# EAGLE design do_ph (EAGLE 9.3.2)
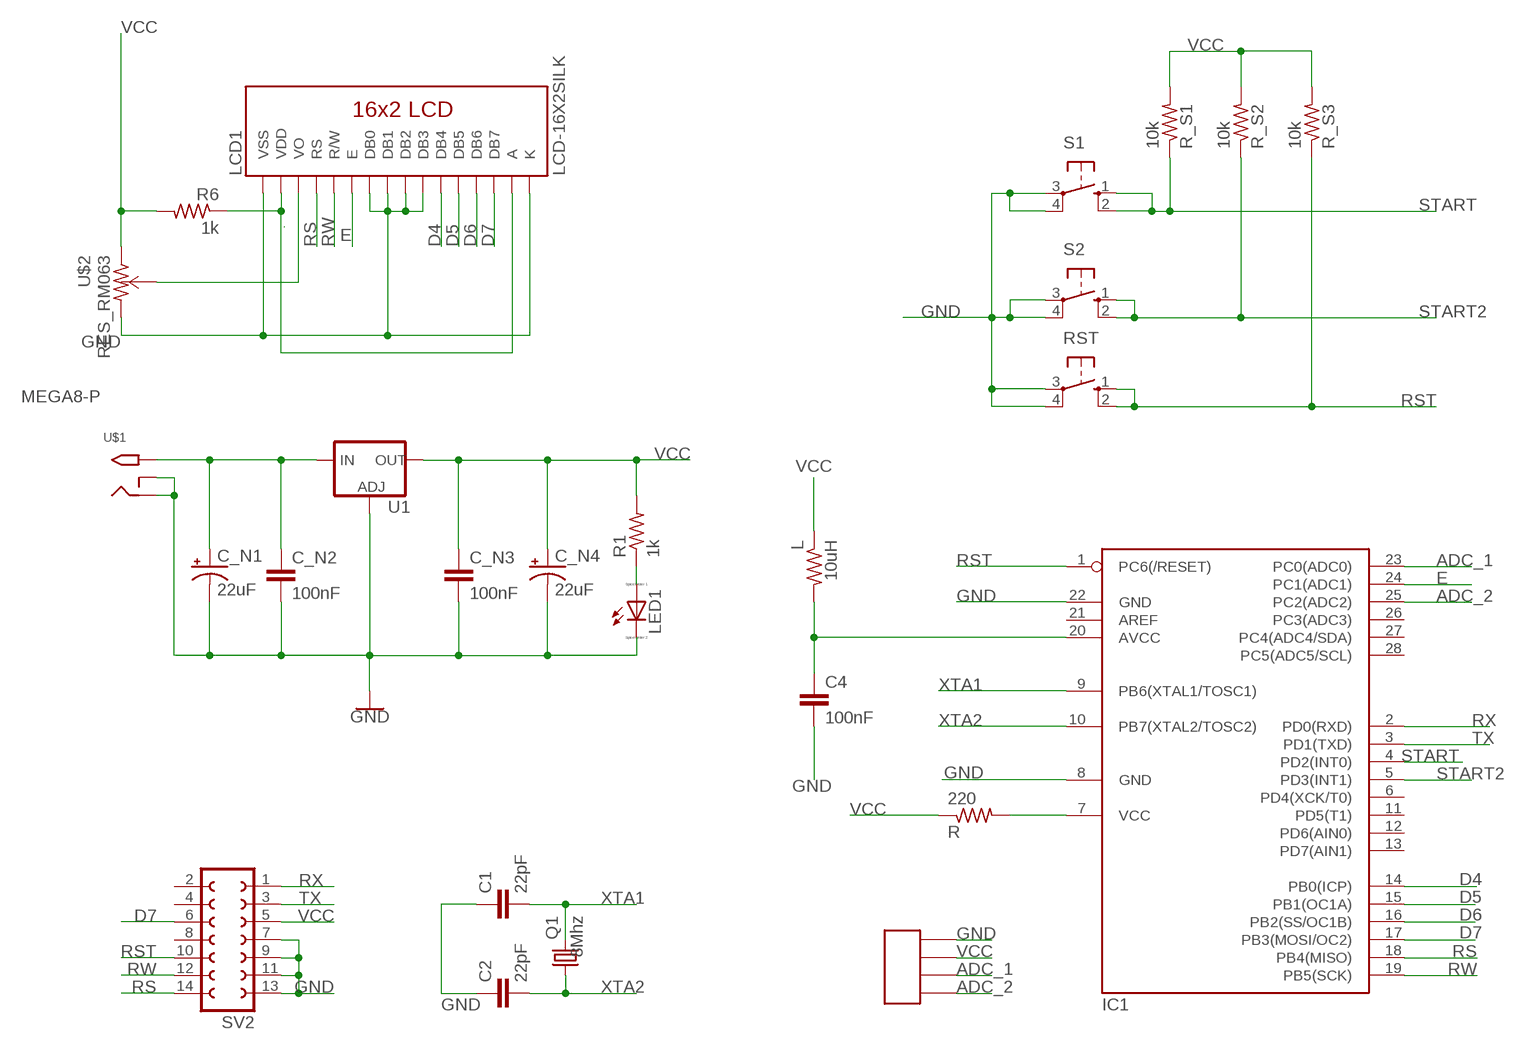
[diagram p0: schematic, sheet 1]

## Parts
C1  22pF  2.2UF-CERCAP-07888  [0402-CAP]
C2  22pF  2.2UF-CERCAP-07888  [0402-CAP]
C4  100nF  1.0UF-0805-25V-(+80/-20%)  [0805]
C_N1  22uF  CPOL-USCT7343  [CT7343]
C_N2  100nF  1.0UF-0805-25V-(+80/-20%)  [0805]
C_N3  100nF  1.0UF-0805-25V-(+80/-20%)  [0805]
C_N4  22uF  CPOL-USCT7343  [CT7343]
IC1  MEGA8-P  [DIL28-3]
L  10uH  R-US_R0805  [R0805]
LCD1  LCD-16X2SILK  [LCD-16X2]
LED1  LED_E  [LED_1206]
Q1  8Mhz  CRYSTALHC49S  [HC49/S]
R  220  R-US_R0805  [R0805]
R1  1k  R-US_R0805  [R0805]
R6  1k  R-US_R0805  [R0805]
R_S1  10k  R-US_R0805  [R0805]
R_S2  10k  R-US_R0805  [R0805]
R_S3  10k  R-US_R0805  [R0805]
RST  10-XX  [B3F-10XX]
S1  10-XX  [B3F-10XX]
S2  10-XX  [B3F-10XX]
SV2  FE07-2  [FE07-2]
U1  V_REG_LM1117SOT223  [SOT223]
U$1  2.1MMJACK  [PJ-102A]
U$2  RES_RM063  [RM063]
U$5  PH_SENSOR_DFROBOT  [PH_DFROBOT]

## Nets
ADC_1: IC1.23(PC0(ADC0)) U$5.S_A(P_A)
ADC_2: IC1.25(PC2(ADC2)) U$5.S_A2(P_A2)
D4: IC1.14(PB0(ICP)) LCD1.11(DB4)
D5: IC1.15(PB1(OC1A)) LCD1.12(DB5)
D6: IC1.16(PB2(SS/OC1B)) LCD1.13(DB6)
D7: IC1.17(PB3(MOSI/OC2)) LCD1.14(DB7) SV2.6
E: IC1.24(PC1(ADC1)) LCD1.6(E)
GND: C1.1 C2.1 C4.2 C_N1.- C_N2.2 C_N3.2 C_N4.- IC1.8(GND) IC1.22(GND) LCD1.1(VSS) LCD1.7(DB0) LCD1.8(DB1) LCD1.9(DB2) LCD1.10(DB3) LCD1.16(K) LED1.C RST.3(P) RST.4(P1) S1.3(P) S1.4(P1) S2.3(P) S2.4(P1) SV2.7 SV2.9 SV2.11 SV2.13 U1.1(ADJ) U$1.RING U$1.RING_SW U$2.P$2 U$5.S_GND(P_GND)
N$1: LCD1.3(VO) U$2.P$3
N$2: C_N1.+ C_N2.1 U1.3(IN) U$1.TIP
N$5: LED1.A R1.1
N$6: C4.1 IC1.20(AVCC) L.2
N$11: IC1.7(VCC) R.2
RS: IC1.18(PB4(MISO)) LCD1.4(RS) SV2.14
RST: IC1.1(PC6(/RESET)) R_S3.1 RST.1(S) RST.2(S1) SV2.10
RW: IC1.19(PB5(SCK)) LCD1.5(R/W) SV2.12
RX: IC1.2(PD0(RXD)) SV2.1
START: IC1.4(PD2(INT0)) R_S1.1 S1.1(S) S1.2(S1)
START2: IC1.5(PD3(INT1)) R_S2.1 S2.1(S) S2.2(S1)
TX: IC1.3(PD1(TXD)) SV2.3
VCC: C_N3.1 C_N4.+ L.1 R1.2 R6.2 R.1 R_S1.2 R_S2.2 R_S3.2 SV2.5 U1.2(OUT) U1.4(OUT) U$2.P$1 U$5.S_VCC(P_VCC)
VO: LCD1.2(VDD) LCD1.15(A) R6.1
XTA1: C1.2 IC1.9(PB6(XTAL1/TOSC1)) Q1.2
XTA2: C2.2 IC1.10(PB7(XTAL2/TOSC2)) Q1.1
Unconnected: IC1.6(PD4(XCK/T0)) IC1.11(PD5(T1)) IC1.12(PD6(AIN0)) IC1.13(PD7(AIN1)) IC1.21(AREF) IC1.26(PC3(ADC3)) IC1.27(PC4(ADC4/SDA)) IC1.28(PC5(ADC5/SCL)) SV2.2 SV2.4 SV2.8

## Library data of the parts
C1 C2 = SparkFun-Retired:2.2UF-CER: 2.2uF Ceramic SMT CAP-07888- 10V, 20% (0603) CAP-10009- 50V, 10% (1206); PROD_ID: CAP-07888; VALUE: 2.2uF
C4 C_N2 C_N3 = SparkFun-Capacitors:1.0UF: 1µF ceramic capacitors A capacitor is a passive two-terminal electrical component used to store electrical energy temporarily in an electric field.; PROD_ID: CAP-11625; VALUE: 1.0uF
C_N1 C_N4 = rcl:CPOL-US: POLARIZED CAPACITOR, American symbol; SPICEPREFIX: C
IC1 = atmel:MEGA8-P: MICROCONTROLLER 8 Kbytes FLASH, 1 kbytes SRAM, 512 bytes EEPROM, USART, 4-channel 10 bit ADC, 2-channel 8 bit ADC Pin compatible with Atmega48, ATMega88, ATMega168 Source: avr.lbr; OC_FARNELL: unknown; OC_NEWARK: unknown
L R R1 R6 R_S1-R_S3 = adafruit:R-US_: RESISTOR, American symbol
LCD1 = SparkFun-Displays:LCD-16X2: Standard text-only 16x2 parallel input LCD Basic 16 character by 2 line display. Typically utilizes the extremely common HD44780 parallel interface chipset SparkFun Products: Basic 16x2 Green <https://www.sparkfun.com/products/255> Basic 8x2 Green <https://www.sparkfun.com/products/11122>; SF_ID: LCD-00255
LED1 = eagle-ltspice:LED_E: LED Source: http://www.osram.convergy.de Source: www.luxeon.com Source: www.kingbright.com; SPICEMODEL: NONE; SPICEPREFIX: D; SPICETYPE: diode
Q1 = crystal:CRYSTAL: CRYSTAL; OC_FARNELL: 1667008; OC_NEWARK: unknown
RST S1 S2 = switch-omron:10-XX: OMRON SWITCH; MPN: B3F-1000; OC_FARNELL: 176432; OC_NEWARK: 36M3542
SV2 = con-lsta:FE07-2: FEMALE HEADER; OC_FARNELL: unknown; OC_NEWARK: unknown
U1 = SparkFun-IC-Power:V_REG_LM1117: Voltage Regulator LM1117 Standard adjustable voltage regulator but in SMD form. Spark Fun Electronics SKU : COM-00595; PROD_ID: VREG-08170
U$1 = adafruit:2.1MMJACK: 2.1mm x 5.5mm DC jack with internal switch. Digikey part #PJ-102A, 4UCON part #05537 By microbuilder.eu
U$2 = res_RM063:RES_RM063
U$5 = PH_SENSOR_DFROBOT:PH_SENSOR_DFROBOT

## Board
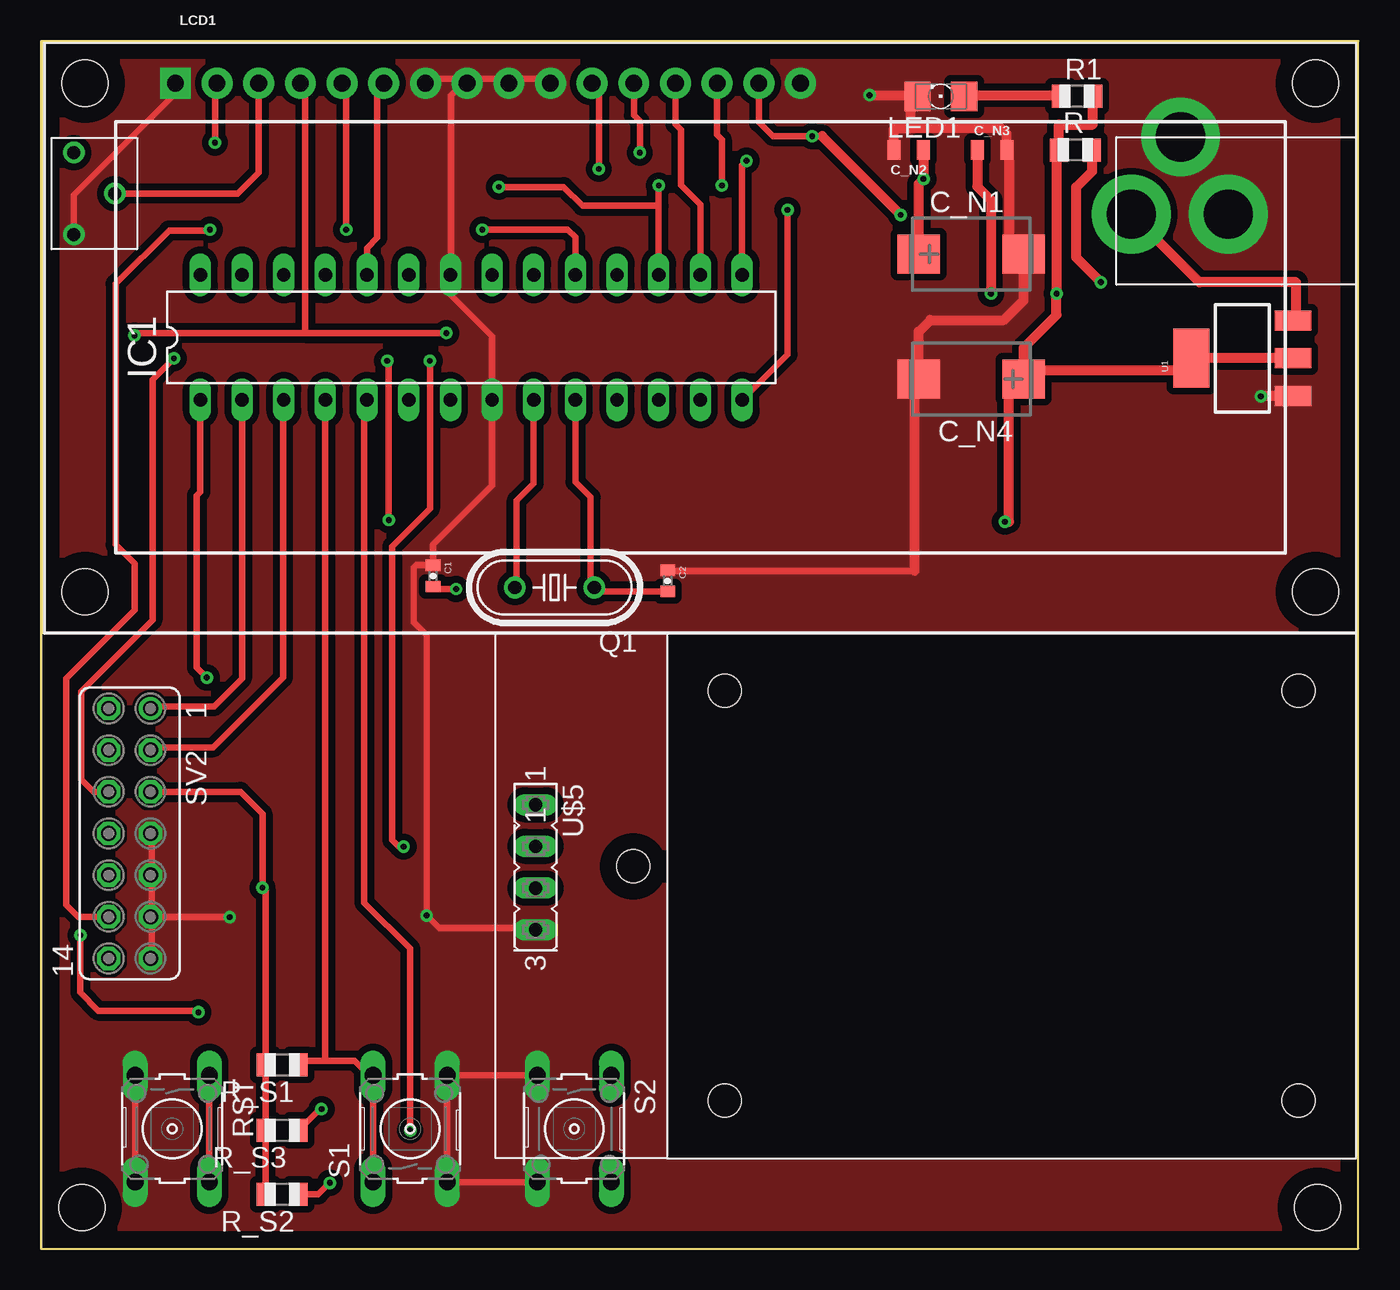
[diagram p1: board, top side]
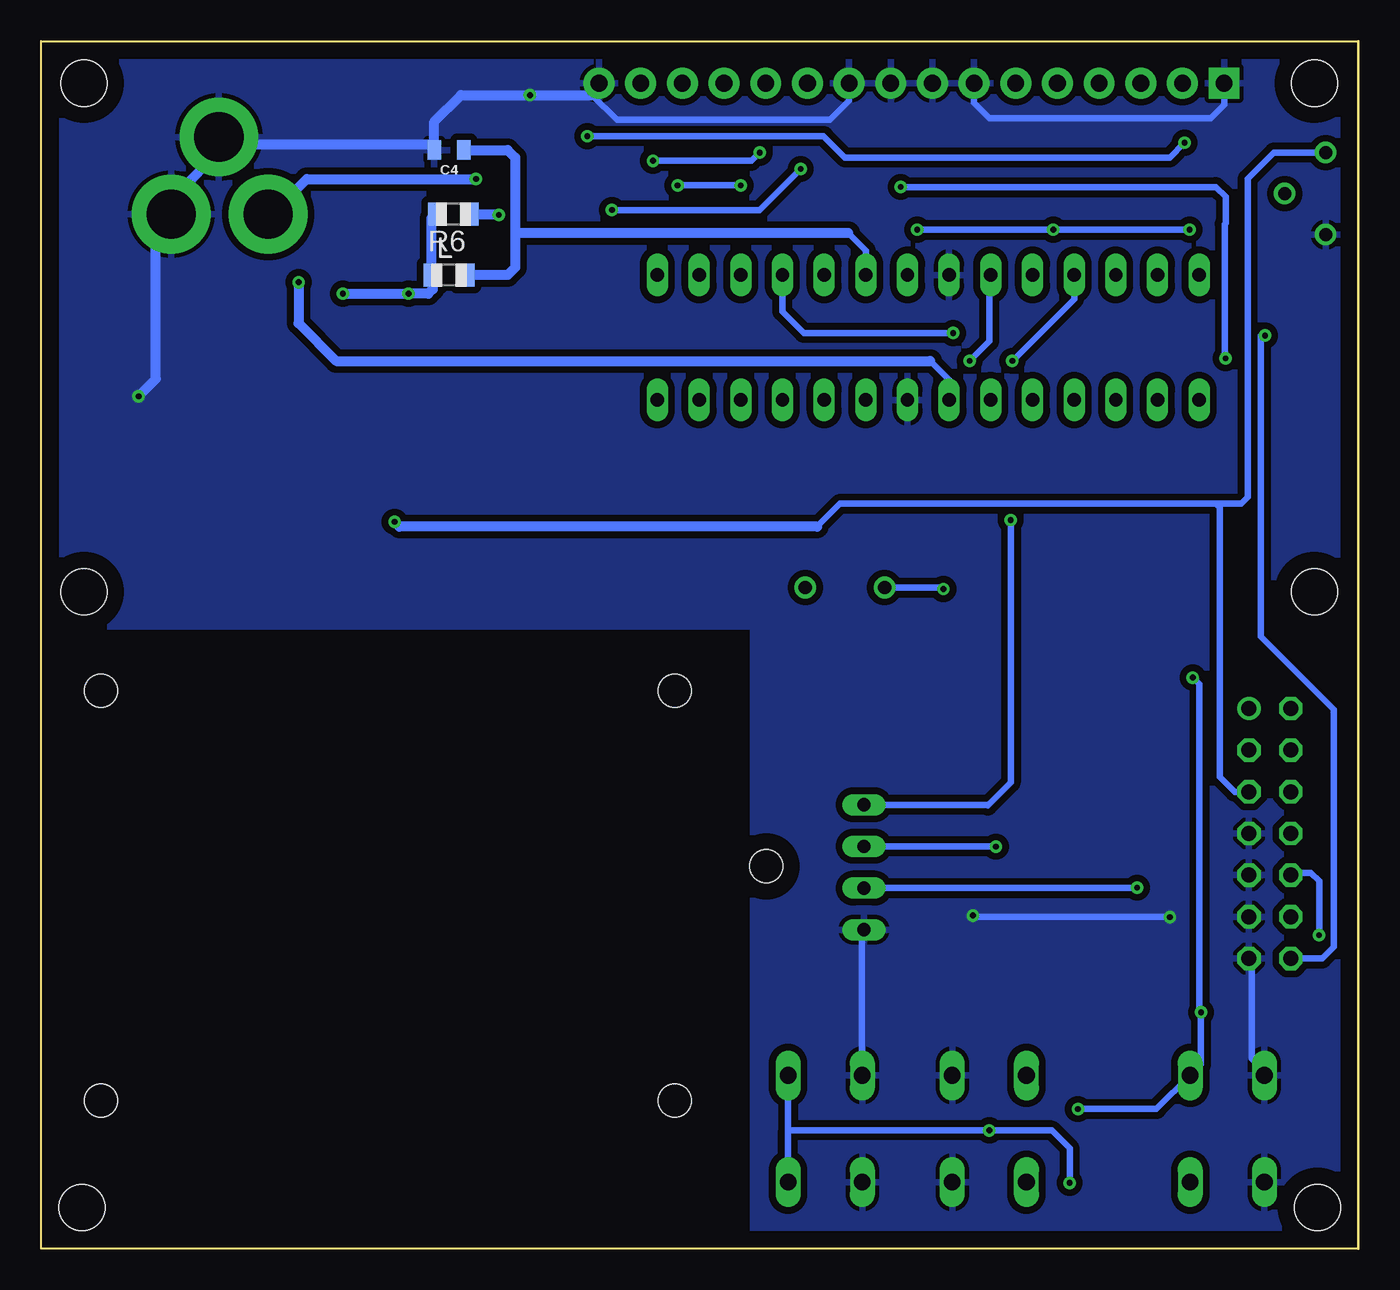
[diagram p2: board, bottom side, seen from below]

Size 80.3 x 73.6 mm. Coordinates in mm from the lower left corner, seen from the top.
Outline: 0,0 80.3,0 80.3,73.6 0,73.6 0,0
Copper layers (1*16): Top 0.035mm / dielectric 1.5mm / Bottom 0.035mm
Design rules "default": minimum track width 6mil, minimum drill 0.35mm, track to track 6mil, track to pad 6mil, pad to pad 6mil, via to via 6mil, smd to smd 6mil, copper to edge 40mil, drill to drill 6mil, minimum pad ring 10mil, minimum via ring 8mil, stop-mask expansion 4mil, vias tented up to drill 0mil, thermal gap 10mil
Holes 2 mm at 36.1,23.3
Holes 2.8 mm at 2.5,2.5 77.8,2.5

### Footprints (pad centres in the part's own frame; a part is rotated, then mirrored left to right if it is on the bottom)
0402-CAP = smd 0.7 x 0.9: 1 -0.65,0; 2 0.65,0
0805 = smd 0.8 x 1.2: 1 -0.9,0; 2 0.9,0
CT7343 = smd 2.6 x 2.4: + -3.2,0; - 3.2,0
DIL28-3 = drill 0.813 long: 1 -16.51,-3.81; 2 -13.97,-3.81; 3 -11.43,-3.81; 4 -8.89,-3.81; 5 -6.35,-3.81; 6 -3.81,-3.81; 7 -1.27,-3.81; 8 1.27,-3.81; 9 3.81,-3.81; 10 6.35,-3.81; 11 8.89,-3.81; 12 11.43,-3.81; 13 13.97,-3.81; 14 16.51,-3.81; 15 16.51,3.81; 16 13.97,3.81; 17 11.43,3.81; 18 8.89,3.81; 19 6.35,3.81; 20 3.81,3.81; 21 1.27,3.81; 22 -1.27,3.81; 23 -3.81,3.81; 24 -6.35,3.81; 25 -8.89,3.81; 26 -11.43,3.81; 27 -13.97,3.81; 28 -16.51,3.81
R0805 = smd 1.1 x 1.4: 1 -1,0; 2 1,0
LCD-16X2 = drill 1.016 pad 1.88 square: 1 -32,15.5 | drill 1.016 pad 1.88: 2 -29.46,15.5; 3 -26.92,15.5; 4 -24.38,15.5; 5 -21.84,15.5; 6 -19.3,15.5; 7 -16.76,15.5; 8 -14.22,15.5; 9 -11.68,15.5; 10 -9.14,15.5; 11 -6.6,15.5; 12 -4.06,15.5; 13 -1.52,15.5; 14 1.02,15.5; 15 3.56,15.5; 16 6.1,15.5 | hole 2.8: -37.5,15.5; -37.5,-15.5; 37.5,15.5; 37.5,-15.5
LED_1206 = smd 1.6 x 1.803: A -1.422,0; C 1.422,0
HC49/S = drill 0.813: 1 -2.413,0; 2 2.413,0
B3F-10XX = drill 1.016 long: 1 -3.251,2.261; 2 3.251,2.261; 3 -3.251,-2.261; 4 3.251,-2.261
FE07-2 = drill 0.914: 1 -7.62,1.27 | drill 0.914 octagon: 2 -7.62,-1.27; 3 -5.08,1.27; 4 -5.08,-1.27; 5 -2.54,1.27; 6 -2.54,-1.27; 7 0,1.27; 8 0,-1.27; 9 2.54,1.27; 10 2.54,-1.27; 11 5.08,1.27; 12 5.08,-1.27; 13 7.62,1.27; 14 7.62,-1.27
SOT223 = smd 1.219 x 2.235: 1 -2.311,-3.099; 2 0,-3.099; 3 2.311,-3.099 | smd 3.6 x 2.2: 4 0,3.099
PJ-102A = drill 3 pad 4.8: RING 0.1,-3.39; RING_SW -4.6,-6.29; TIP 0.1,-9.29
RM063 = drill 0.8: P$1 -2.5,0; P$2 2.5,0; P$3 0,2.5
PH_DFROBOT = drill 0.813 long: S_A 36.86,-1.81; S_A2 36.86,-4.35; S_GND 36.86,3.27; S_VCC 36.86,0.73 | hole 2: 25.34,13.69; 25.34,-11.31; -9.66,13.69; -9.66,-11.31

### Placement (x,y rotation side)
C1  23.9,41 270 top
C2  38.2,40.7 270 top
C4  55.43,66.96 180 bottom
C_N1  56.7,60.61 0 top
C_N2  52.89,66.96 180 top
C_N3  57.97,66.96 0 top
C_N4  56.7,52.99 180 top
IC1  26.22,55.53 0 top
L  55.43,59.34 0 bottom
LCD1  40.19,55.53 0 top
LED1  54.84,70.23 180 top
Q1  31.3,40.29 180 top
R  63.05,66.96 0 top
R1  63.15,70.23 0 top
R6  55.17,63.05 180 bottom
R_S1  14.7,11.2 180 top
R_S2  14.7,3.3 180 top
R_S3  14.7,7.2 180 top
RST  8,7.3 270 top
S1  22.5,7.3 90 top
S2  32.5,7.3 270 top
SV2  5.4,25.3 270 top
U1  73.21,54.26 90 top
U$1  75.75,63.15 270 top
U$2  2,64.3 270 top
U$5  67,22.7 180 top

### Tracks (layer width: path | path; a pad name or v marks a point on that pad's centre or on a via)
ADC_1  (via drill 0.35)
  Top 0.406: v23.7,54.1 23.7,45.1 21.4,42.8 21.4,24.9 21.8,24.5 v22.1,24.5
  Bottom 0.406: IC1.23 22.5,59.3 22.5,55.3 v23.7,54.1 | v22.1,24.5 U$5.S_A
ADC_2  (via drill 0.35)
  Top 0.406: v21.1,54.1 21.2,54 v21.2,44.4
  Bottom 0.406: IC1.25 17.33,57.87 v21.1,54.1 | v21.2,44.4 21.2,28.4 22.6,27 22.65,27.05 U$5.S_A2
D4  (via drill 0.35)
  Top 0.406: v34,65.8 34,70.8 LCD1.11 | IC1.14 45.5,54.49 v45.5,63.3
  Bottom 0.406: v45.5,63.3 36.5,63.3 v34,65.8
D5  (via drill 0.35)
  Top 0.406: v36.5,66.8 36.5,68.7 36.13,69.07 LCD1.12 | IC1.15 42.73,66.03 v43,66.3
  Bottom 0.406: v43,66.3 37,66.3 v36.5,66.8
D6
  Top 0.406: IC1.16 40.19,63.61 39,64.8 39,68.2 38.67,68.53 LCD1.13
D7  (via drill 0.35)
  Top 0.406: v41.5,64.8 41.5,67.6 41.21,67.89 LCD1.14 | IC1.17 37.65,63.55 | 37.65,63.55 v37.65,64.8 37.55,64.7 | SV2.6 3.21,27.84 2.45,28.6 2.45,33.95 6.8,38.3 6.8,52.95 v8.1,54.25 | 37.65,63.55 33,63.55 31.85,64.7 v27.9,64.7 28,64.55
  Bottom 0.406: v37.65,64.8 v41.5,64.8 | v8.1,54.25 8.15,54.3 8.15,62.45 8.1,62.5 8.1,64.1 8.7,64.7 v27.9,64.7
E
  Top 0.406: LCD1.6 20.5,70.8 20.5,61.6 19.87,60.97 IC1.24
GND  (via drill 0.35)
  Top 0.406: LCD1.7 23.5,71.3 25.5,71.3 LCD1.8 | LCD1.10 31,71.3 29,71.3 LCD1.9 28.5,71.3 26,71.3 LCD1.8 | LCD1.8 25.5,70.8 25,70.3 25,59.8 IC1.22 24.95,58.15 27.5,55.6 IC1.8 27.49,46.49 23.9,42.9 C1.1 22.85,41.65 22.7,41.5 22.7,38.2 23.5,37.4 v23.5,20.3 24.25,19.55 30,19.55 U$5.S_GND | 53.25,41.3 38.25,41.3 C2.1 | RST.4 RST.3 | SV2.13 6.75,17.8 6.75,20.05 SV2.11 | SV2.7 6.75,25.3 6.75,22.8 SV2.9 6.75,22.55 6.75,20.3 SV2.11 | U$2.P$2 2,64.2 8.19,70.39 LCD1.1 | S2.4 30,4.05 25,4.05 S1.3 S1.4 25,10.55 30,10.55 S2.3 | v11.5,20.2 6.69,20.2 SV2.11
  Top 0.61: 53,68.3 53,69.8 LED1.C 53,70.3 v50.5,70.3 | 53,68.3 58.5,68.3 58.87,67.93 C_N3.2 59,66.8 59,61.3 59.5,60.8 C_N1.- 59.9,57.8 58.7,56.6 54.2,56.6 53.5,55.9 C_N4.- 53.5,52.8 53.25,52.55 53.25,41.3 | U1.1 v74.35,51.95 | C_N2.2 51.99,68.3 53,68.3
  Bottom 0.406: LCD1.7 23.43,69.83 22.5,68.9 9,68.9 8.19,69.71 LCD1.1 | LCD1.10 31.05,69.95 32.2,68.8 45.2,68.8 46.7,70.3 46.29,70.71 LCD1.16 | RST.3 5.75,10.8 6.5,11.55 6.5,17.55 SV2.13 | U$5.S_GND 30.25,19.3 30.25,10.8 S2.3 | v23.5,20.3 23.4,20.2 v11.5,20.2
  Bottom 0.61: 69,67.3 56.5,67.3 C4.2 56.33,68.67 54.7,70.3 v50.5,70.3 46.7,70.3 | v74.35,51.95 73.3,53 73.3,62.11 U$1.RING 72.36,63.94 69,67.3 | 69,67.3 U$1.RING_SW
  pour Top (isolate 0.406, no thermals): 79.75,73.6 arc-90 80,73.35 80,37.7 38.25,37.7 arc90 38,37.45 38,5.3 80.35,5.3 arc-90 80.6,5.05 80.6,-0.2 0.25,-0.2 arc-90 0,0.05 0,73.5
  pour Bottom (isolate 0.406): 0.2,73.6 80.2,73.6 80.2,37.9 36.9,37.9 36.9,0.1 0.2,0.1
N$1
  Top 0.406: LCD1.3 13.27,65.57 12,64.3 U$2.P$3
N$2  (via drill 0.35)
  Top 0.61: C_N1.+ 53.5,64.9 v53.79,65.19 C_N2.1 | U1.3 76.5,56.8 76.5,58.9 70.61,58.9 U$1.TIP
  Bottom 0.61: v53.79,65.19 64.11,65.19 66,63.3 66.39,63.09 U$1.TIP
N$5
  Top 0.61: LED1.A 56.5,70.3 62,70.3 R1.1
N$6
  Bottom 0.406: IC1.20 30.03,60.83 31.1,61.9
  Bottom 0.61: 31.1,61.9 51.4,61.9 | C4.1 51.86,66.96 51.4,66.5 51.4,61.9 | 51.4,61.9 51.4,59.8 51.86,59.34 L.2
N$11  (via drill 0.35)
  Top 0.61: R.2 64.05,65.65 63.1,64.7 63.1,60.4 v64.6,58.9
  Bottom 0.406: IC1.7 24.95,52.95 26.1,54.1
  Bottom 0.61: 26.1,54.1 62.3,54.1 64.6,56.4 v64.6,58.9
RS  (via drill 0.35)
  Top 0.406: 16.1,55.8 v24.7,55.8 | 16.1,55.8 16.1,70.8 LCD1.4 | v5.7,55.65 5.85,55.8 16.1,55.8
  Bottom 0.406: IC1.18 35.11,57.11 33.8,55.8 v24.7,55.8 | v5.7,55.65 5.95,55.65 5.95,37.3 1.5,32.85 1.5,18.4 2.22,17.68 SV2.14
RST  (via drill 0.35)
  Top 0.406: RST.1 RST.2 | v10.1,34.8 9.5,35.4 9.5,45.9 9.71,46.11 IC1.1 | v2.4,19.1 2.4,15.6 3.5,14.5 9.5,14.5 v9.6,14.4 | R_S3.1 17,8.5 v17.1,8.5
  Bottom 0.406: v10.1,34.8 9.7,34.4 9.7,14.5 v9.6,14.4 9.6,11.21 RST.1 12.31,8.5 v17.1,8.5 | v2.4,19.1 2.4,22.4 2.9,22.9 3.99,22.9 SV2.10
RW  (via drill 0.35)
  Top 0.406: LCD1.5 18.6,70.88 v18.6,62.1 | IC1.19 32.57,61.63 32.1,62.1 v26.9,62.1 | v10.3,62.1 10.25,62.05 7.8,62.05 4.55,58.8 4.55,42.9 5.7,41.75 5.7,38.91 1.55,34.76 1.55,20.95 2.28,20.22 SV2.12
  Bottom 0.406: v26.9,62.1 v18.6,62.1 v10.3,62.1
RX
  Top 0.406: SV2.1 6.75,33.05 10.55,33.05 12.25,34.75 IC1.2
START
  Top 0.406: R_S1.1 15.95,11.45 17.4,11.45 | 17.4,11.45 19.1,11.45 20,10.55 S1.2 S1.1 | 17.4,11.45 17.33,11.52 IC1.4
START2  (via drill 0.35)
  Top 0.406: IC1.5 19.7,51.55 19.7,21.08 22.5,18.28 v22.5,7.2 | v17.6,4 16.9,3.3 R_S2.1
  Bottom 0.406: S2.2 34.76,7.2 | 34.76,7.2 v22.5,7.2 18.7,7.2 17.6,6.1 v17.6,4 | S2.1 34.76,7.2
TX
  Top 0.406: IC1.3 14.75,51.55 14.75,34.8 10.5,30.55 6.75,30.55 SV2.3
VCC  (via drill 0.35)
  Top 0.406: SV2.5 12.16,27.84 13.5,26.5 v13.5,22 13.7,21.8 R_S1.2 R_S3.2 R_S2.2
  Top 0.61: v57.9,58.2 57.9,63.9 57.07,64.73 C_N3.1 | C_N4.+ 59.5,52.8 59,52.3 59,44.3 v58.75,44.3 | C_N4.+ 60.49,52.99 61,53.5 69.35,53.5 U1.4 U1.2 | R1.2 64.1,70.18 64.1,68.5 62.05,68.5 R.1 62,66.8 61.9,66.7 v61.9,58.2 61.9,56.9 59.9,54.9 C_N4.+
  Bottom 0.406: SV2.5 7.54,27.84 8.45,28.75 8.45,45.15 8.7,45.4 | 33,44 31.6,45.4 8.7,45.4 | 8.7,45.4 7.15,45.4 6.75,45.8 6.75,65.2 5.15,66.8 U$2.P$1 | v13.5,22 13.53,21.97 U$5.S_VCC
  Bottom 0.61: v61.9,58.2 v57.9,58.2 56.7,58.2 56.43,58.47 L.1 56.5,59.8 56.5,62.8 R6.2 | v58.75,44.3 58.45,44 33,44
VO  (via drill 0.35)
  Top 0.406: LCD1.15 43.75,68.65 44.6,67.8 v47,67.8 47.6,67.8 | LCD1.2 10.6,70.9 v10.6,67.4
  Top 0.61: v52.4,63 47.6,67.8
  Bottom 0.406: v10.6,67.4 11.5,66.5 31.3,66.5 32.6,67.8 v47,67.8
  Bottom 0.61: R6.1 52.45,63.05 v52.4,63
XTA1  (via drill 0.35)
  Top 0.406: Q1.2 29,40.3 29,45.6 30.03,46.63 IC1.9 | v25.3,40.2 24.05,40.2 C1.2
  Bottom 0.406: v25.3,40.2 25.4,40.3 28.5,40.3 Q1.2
XTA2
  Top 0.406: C2.2 33.95,40.05 Q1.1 33.5,40.3 33.5,45.8 32.57,46.73 IC1.10